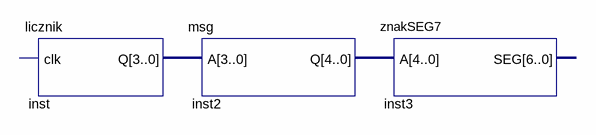
[diagram p0: schematic sheet]
// Quartus schematic reklama.bdf as structural Verilog: 3 symbols, 0 pins
module reklama (
);

  wire [3:0] inst_q;
  wire [4:0] inst2_q;

  licznik inst (.Q(inst_q));  // open: clk
  msg inst2 (.A(inst_q), .Q(inst2_q));
  znakSEG7 inst3 (.A(inst2_q));  // open: SEG
endmodule
